# EAGLE design FT232_V2 (EAGLE 7.2.0)
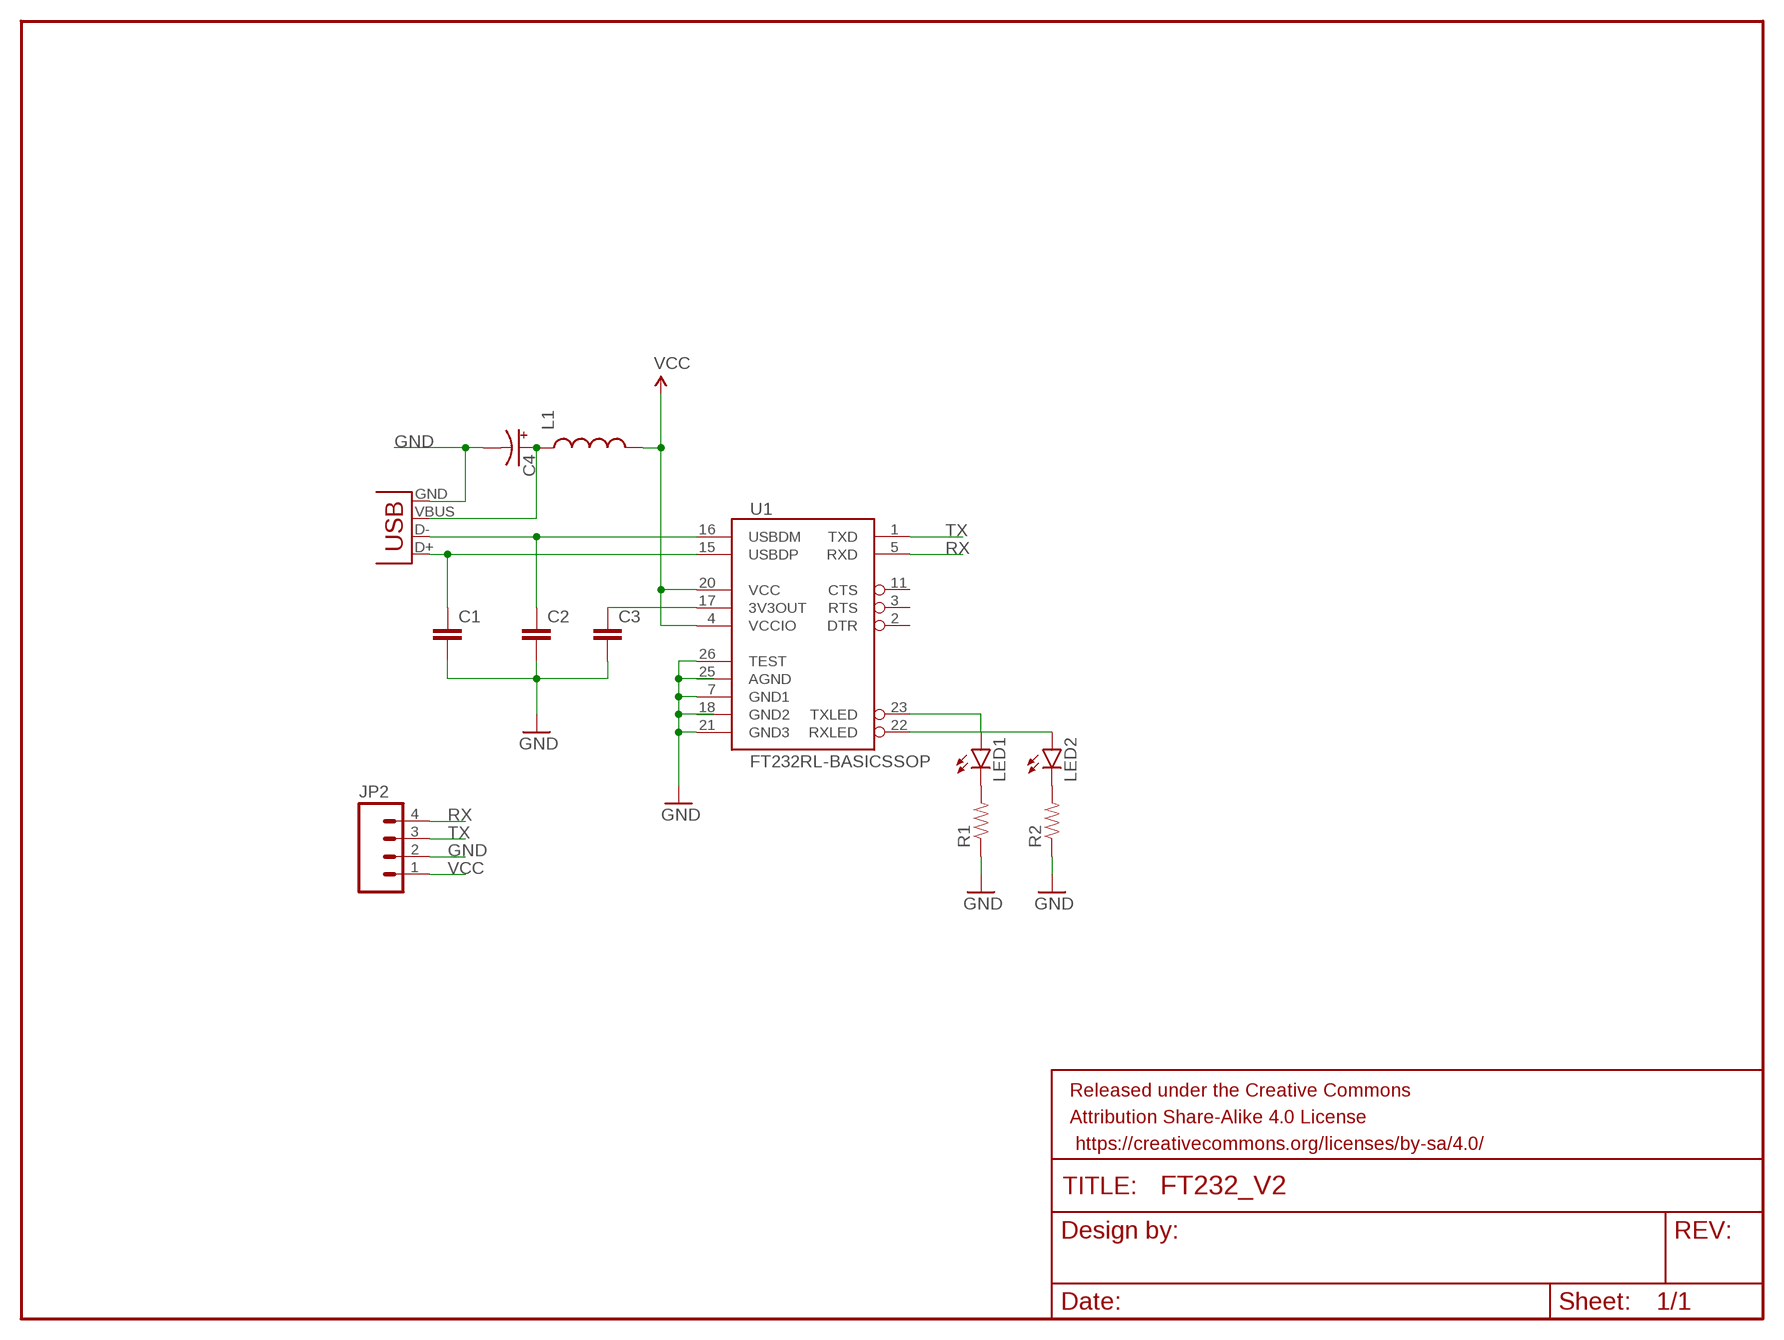
[diagram p0: schematic, sheet 1]

## Parts
C1  CAP0603-CAP  [0603-CAP]
C2  CAP0603-CAP  [0603-CAP]
C3  CAP0603-CAP  [0603-CAP]
C4  CAP_POL1206  [EIA3216]
FRAME1  FRAME-LETTER  [CREATIVE_COMMONS]
JP1  USB-B  USBPTH  [USB-B-PTH]
JP2  M04PTH  [1X04]
L1  INDUCTOR0603  [0603]
LED1  LED0603  [LED-0603]
LED2  LED0603  [LED-0603]
R1  RESISTOR0603  [0603-RES]
R2  RESISTOR0603  [0603-RES]
U1  FT232RL-BASICSSOP  [SSOP28DB]

## Nets
GND: C1.2 C2.2 C3.2 C4.C(-) JP1.GND JP2.2 R1.1 R2.1 U1.7(GND1) U1.21(GND3) U1.26(TEST)
N$1: C2.1 JP1.D- U1.16(USBDM)
N$2: C3.1 U1.17(3V3OUT)
N$3: C4.A(+) JP1.VBUS L1.1
N$4: C1.1 JP1.D+ U1.15(USBDP)
N$5: LED1.C R1.2
N$6: LED2.C R2.2
N$7: LED1.A U1.23(TXLED)
N$8: LED2.A U1.22(RXLED)
RX: JP2.4 U1.5(RXD)
TX: JP2.3 U1.1(TXD)
VCC: JP2.1 L1.2 U1.4(VCCIO) U1.20(VCC)
Unconnected: U1.2(DTR) U1.3(RTS) U1.11(CTS)

## Power pins joined to a net without a drawn wire
AGND: U1.25(AGND)
GND2: U1.18(GND2)

## Library data of the parts
C1-C3 = SparkFun-Capacitors:CAP: Capacitor Standard 0603 ceramic capacitor, and 0.1" leaded capacitor.
C4 = SparkFun-Capacitors:CAP_POL: Capacitor Polarized These are standard SMD and PTH capacitors. Normally 10uF, 47uF, and 100uF in electrolytic and tantalum varieties. Always verify the external diameter of the through hole cap, it varies with capacity, voltage, and manufacturer. The EIA devices should be standard.
FRAME1 = SparkFun-Aesthetics:FRAME-LETTER: Schematic Frame Standard 8.5x11 US Letter frame
JP1 = SparkFun-Connectors:USB: USB Connectors USB-B-PTH is fully proven SKU : PRT-00139/CONN-08278 USB-miniB is fully proven SKU : PRT-00587 USB-A-PCB is untested. USB-A-H is throughly reviewed, but untested. Spark Fun Electronics SKU : PRT-00437 USB-B-SMT is throughly reviewed, but untested. Needs silkscreen touching up. USB-A-S has not been used/tested USB-MB-H has not been used/tested USB-MICROB has been used. CONN-09505; PROD_ID: CONN-08278
JP2 = SparkFun-Connectors:M04: Header 4 Standard 4-pin 0.1" header. Use with straight break away headers (SKU : PRT-00116), right angle break away headers (PRT-00553), swiss pins (PRT-00743), machine pins (PRT-00117), and female headers (PRT-00115). Molex polarized connector foot print use with SKU : PRT-08231 with associated crimp pins and housings. 1MM SMD Version SKU: PRT-10208
L1 = SparkFun-Passives:INDUCTOR: Inductors Basic Inductor/Choke - 0603 and 1206. Footprints are not proven and vary greatly between part numbers. SRN6045- 33uH, 20% 1.4A SDR0403-560KL - 56uH, 10%, 500mA RMS/740mA peak
LED1 LED2 = SparkFun-LED:LED: LEDs Standard schematic elements and footprints for 5mm, 3mm, 1206, and 0603 sized LEDs. 5mm - Spark Fun Electronics SKU : COM-00529 (and others)
R1 R2 = SparkFun-Resistors:RESISTOR: Resistor Basic schematic elements and footprints for 0603, 1206, and PTH resistors.
U1 = SparkFun-DigitalIC:FT232RL-BASIC: USB UART This is the simplified version of the FT232RL unit. Only what you need, nothing you don't. Spark Fun Electronics SKU : COM-00650

## Board
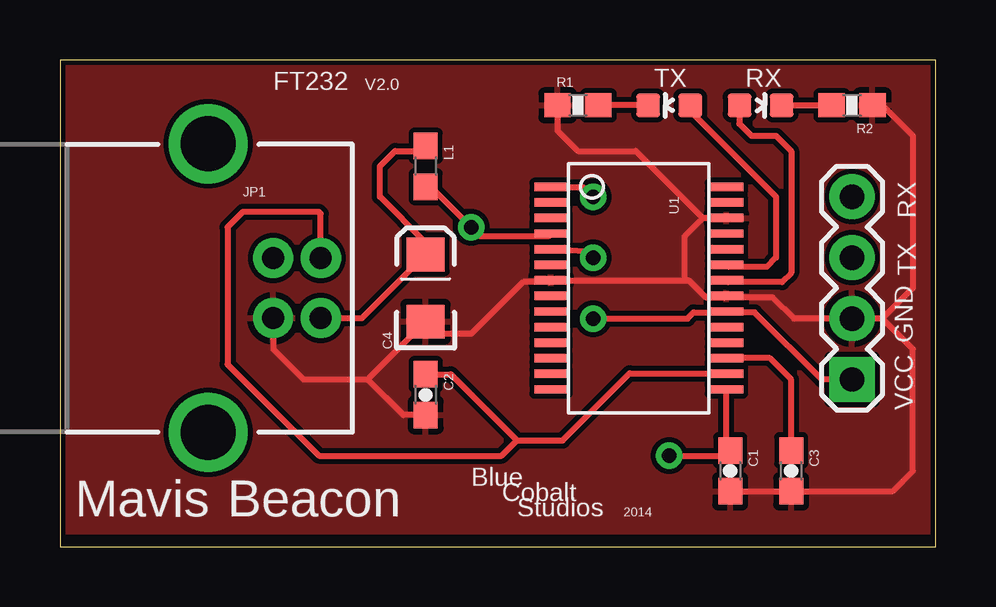
[diagram p1: board, top side]
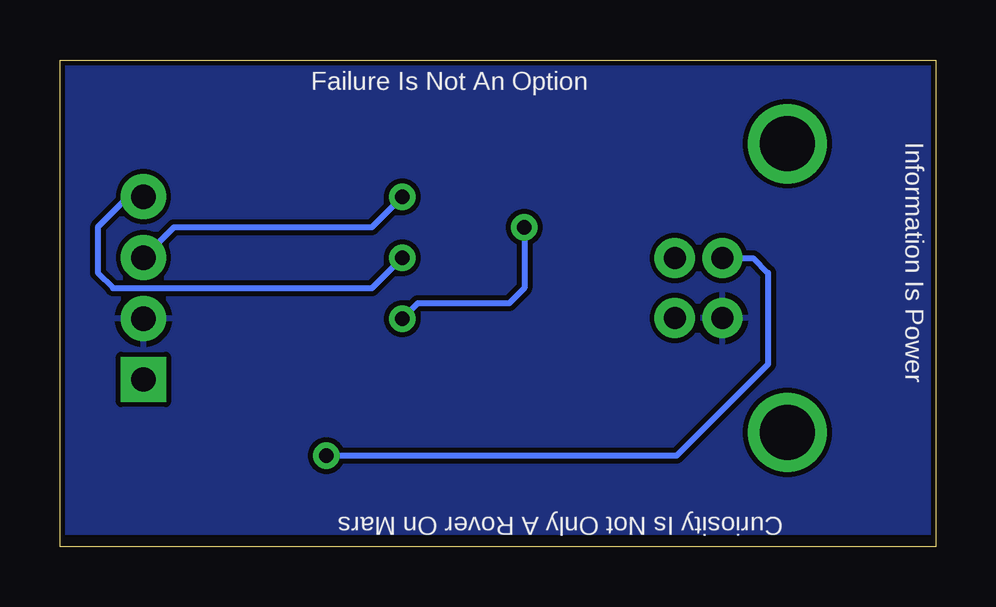
[diagram p2: board, bottom side, seen from below]

Size 36.5 x 20.31 mm. Coordinates in mm from the lower left corner, seen from the top.
Outline: 0,0 36.5,0 36.5,20.31 0,20.31 0,0
Copper layers (1*16): Top 0.035mm / dielectric 1.5mm / Bottom 0.035mm
Design rules "SparkFun": minimum track width 8mil, minimum drill 20mil, track to track 8mil, track to pad 8mil, pad to pad 8mil, via to via 8mil, smd to smd 8mil, copper to edge 8mil, drill to drill 8mil, minimum pad ring 12mil, minimum via ring 10mil, stop-mask expansion 4mil, vias tented up to drill 20mil, thermal gap 10mil

### Footprints (pad centres in the part's own frame; a part is rotated, then mirrored left to right if it is on the bottom)
0603-CAP = smd 1.1 x 1: 1 -0.85,0; 2 0.85,0
EIA3216 = smd 1.4 x 1.6: A 1.4,0; C -1.4,0
USB-B-PTH = drill 0.914 pad 1.676: D+ 0,1.25; D- 1.981,1.25; GND 0,-1.25; VBUS 1.981,-1.25 | drill 2.286: S1 -2.718,-6.02; S2 -2.718,6.02
1X04 = drill 1.016 pad 1.88 square: 1 0,0 | drill 1.016 pad 1.88: 2 2.54,0; 3 5.08,0; 4 7.62,0
0603 = smd 1.1 x 1: 1 -0.85,0; 2 0.85,0
LED-0603 = smd 1 x 1: A 0,-0.877; C 0,0.877
0603-RES = smd 1.1 x 1: 1 -0.85,0; 2 0.85,0
SSOP28DB = smd 0.348 x 1.397: 1 -4.225,-3.656; 2 -3.575,-3.656; 3 -2.925,-3.656; 4 -2.275,-3.656; 5 -1.625,-3.656; 6 -0.975,-3.656; 7 -0.325,-3.656; 8 0.325,-3.656; 9 0.975,-3.656; 10 1.625,-3.656; 11 2.275,-3.656; 12 2.925,-3.656; 13 3.575,-3.656; 14 4.225,-3.656; 15 4.225,3.656; 16 3.575,3.656; 17 2.925,3.656; 18 2.275,3.656; 19 1.625,3.656; 20 0.975,3.656; 21 0.325,3.656; 22 -0.325,3.656; 23 -0.975,3.656; 24 -1.625,3.656; 25 -2.275,3.656; 26 -2.925,3.656; 27 -3.575,3.656; 28 -4.225,3.656

### Placement (x,y rotation side)
C1  27.94,3.17 270 top
C2  15.24,6.35 270 top
C3  30.48,3.17 270 top
C4  15.24,10.79 90 top
FRAME1  -77.47,15.88 0 top  (outside the outline)
JP1  8.89,10.79 0 top
JP2  33.02,6.99 90 top
L1  15.24,15.88 270 top
LED1  25.4,18.41 90 top
LED2  29.21,18.41 270 top
R1  21.59,18.41 0 top
R2  33.02,18.41 180 top
U1  24.13,10.79 270 top

### Tracks (layer width: path | path; a pad name or v marks a point on that pad's centre or on a via)
GND
  Top 0.254: C1.2 C3.2 34.71,2.33 35.56,3.17 35.56,8.26 34.29,9.53 | 34.29,9.53 JP2.2 30.61,9.53 29.72,10.41 27.84,10.41 U1.21 | R2.1 34.29,18.41 35.56,17.14 35.56,10.79 34.29,9.53 | JP1.GND 8.89,8.26 10.16,6.99 12.83,6.99 | 12.83,6.99 C4.C 15.74,8.89 17.14,8.89 19.3,11.05 20.4,11.05 U1.7 26.04,11.12 | U1.21 27.63,10.47 | 26.04,11.12 26.22,11.12 26.92,10.41 27.73,10.41 U1.21 | U1.26 26.8,13.72 | 26.8,13.72 26.04,12.95 26.04,11.12 | C2.2 14.31,5.5 12.83,6.99 | R1.1 20.74,17.36 21.59,16.51 24,16.51 26.8,13.72
  pour Top: 0,20.32 36.45,20.32 36.45,18.54 36.45,0.64 0,0.64
  pour Bottom: 0,20.32 36.45,20.32 36.45,0.64 0,0.64
N$1
  Top 0.254: C2.1 16.3,7.2 19.05,4.44 | 19.05,4.44 20.95,4.44 23.75,7.24 27.77,7.24 U1.16 | JP1.D- 10.87,13.89 10.79,13.97 7.62,13.97 6.99,13.34 6.99,7.62 10.79,3.81 18.41,3.81 19.05,4.44
N$2
  Top 0.254: C3.1 30.48,6.99 29.59,7.87 U1.17
N$3
  Top 0.254: JP1.VBUS 12.59,9.54 C4.A 15.24,12.7 13.34,14.61 13.34,15.88 13.97,16.51 15.03,16.51 L1.1
N$4  (via drill 0.6)
  Top 0.254: U1.15 27.79,4.02 C1.1 27.73,3.81 v25.4,3.81
  Bottom 0.254: JP1.D+ 7.6,12.04 6.99,11.43 6.99,7.62 10.79,3.81 v25.4,3.81
N$5
  Top 0.254: LED1.C R1.2
N$6
  Top 0.254: LED2.C R2.2
N$7
  Top 0.254: LED1.A 26.28,18.17 29.84,14.61 29.84,12.07 29.46,11.68 27.87,11.68 U1.23
N$8
  Top 0.254: LED2.A 28.32,18.4 28.32,17.65 28.83,17.14 29.84,17.14 30.48,16.51 30.48,11.43 30.1,11.05 27.86,11.05 U1.22
RX  (via drill 0.6)
  Top 0.254: v22.23,12.07 21.84,12.32 U1.5
  Bottom 0.254: JP2.4 33.66,14.61 34.92,13.34 34.92,11.43 34.29,10.79 23.5,10.79 v22.23,12.07
TX  (via drill 0.6)
  Top 0.254: v22.23,14.61 21.84,14.99 20.51,14.99 U1.1
  Bottom 0.254: JP2.3 31.75,13.34 23.5,13.34 v22.23,14.61
VCC  (via drill 0.6)
  Top 0.254: JP2.1 31.75,6.99 28.96,9.78 27.83,9.78 U1.20 27.75,9.78 26.42,9.78 26.16,9.53 v22.23,9.53 | 20.46,13.08 U1.4 20.36,12.95 17.53,12.95 v17.14,13.34 15.46,15.03 L1.2
  Bottom 0.254: v17.14,13.34 17.14,10.79 17.78,10.16 21.59,10.16 v22.23,9.53

### Text on the board
tPlace: FT232 | V2.0 | TX | RX | RX | TX | GND | VCC | Blue | Cobalt | Mavis | Beacon | Studios | 2014
bPlace: Failure Is Not An Option | Information Is Power | Curiosity Is Not Only A Rover On Mars